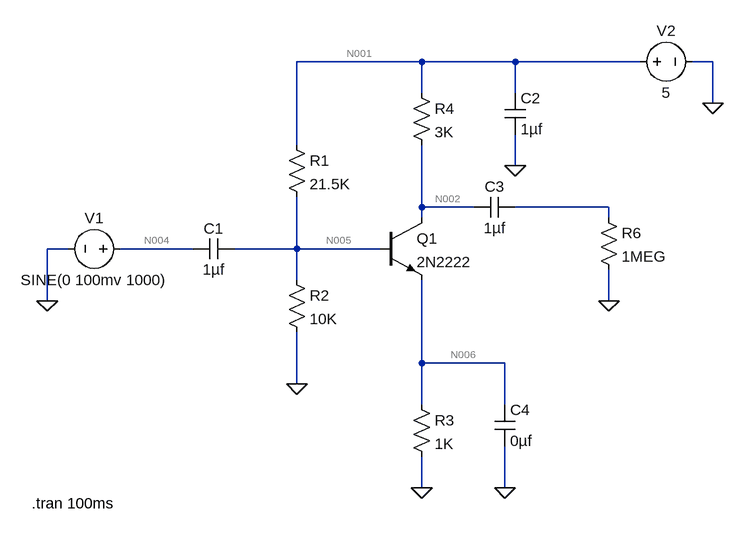
[diagram p0: schematic class_a_amplifier_5v_vcc.asc]
class_a_amplifier_5v_vcc.asc, the LTspice schematic file:
Version 4
SHEET 1 924 680
WIRE 32 -64 -160 -64
WIRE 176 -64 32 -64
WIRE 368 -64 176 -64
WIRE 480 -64 448 -64
WIRE 32 -16 32 -64
WIRE 176 -16 176 -64
WIRE 480 0 480 -64
WIRE -160 64 -160 -64
WIRE 176 96 176 48
WIRE 32 160 32 64
WIRE 112 160 32 160
WIRE 320 160 176 160
WIRE 32 176 32 160
WIRE 320 176 320 160
WIRE -512 224 -544 224
WIRE -320 224 -432 224
WIRE -160 224 -160 144
WIRE -160 224 -256 224
WIRE -32 224 -160 224
WIRE -160 272 -160 224
WIRE -544 304 -544 224
WIRE 320 304 320 256
WIRE 32 400 32 272
WIRE 160 400 32 400
WIRE -160 432 -160 352
WIRE 32 464 32 400
WIRE 160 464 160 400
WIRE 32 592 32 544
WIRE 160 592 160 528
FLAG 480 0 0
FLAG 32 592 0
FLAG -160 432 0
FLAG -544 304 0
FLAG 320 304 0
FLAG 176 96 0
FLAG 160 592 0
SYMBOL voltage -416 224 R90
WINDOW 0 -32 56 VBottom 2
WINDOW 3 32 56 VTop 2
WINDOW 123 60 56 VTop 2
WINDOW 39 0 0 Left 2
SYMATTR InstName V1
SYMATTR Value SINE(0 100mv 1000)
SYMBOL voltage 352 -64 R270
WINDOW 0 32 56 VTop 2
WINDOW 3 -32 56 VBottom 2
WINDOW 123 0 0 Left 2
WINDOW 39 0 0 Left 2
SYMATTR InstName V2
SYMATTR Value 5
SYMBOL cap -256 208 R90
WINDOW 0 0 32 VBottom 2
WINDOW 3 32 32 VTop 2
SYMATTR InstName C1
SYMATTR Value 1µf
SYMBOL res -176 48 R0
SYMATTR InstName R1
SYMATTR Value 21.5K
SYMBOL res -176 256 R0
SYMATTR InstName R2
SYMATTR Value 10K
SYMBOL res 16 -32 R0
SYMATTR InstName R4
SYMATTR Value 3K
SYMBOL res 16 448 R0
SYMATTR InstName R3
SYMATTR Value 1K
SYMBOL cap 112 176 R270
WINDOW 0 32 32 VTop 2
WINDOW 3 0 32 VBottom 2
SYMATTR InstName C3
SYMATTR Value 1µf
SYMBOL npn -32 176 R0
SYMATTR InstName Q1
SYMATTR Value 2N2222
SYMBOL res 304 160 R0
SYMATTR InstName R6
SYMATTR Value 1MEG
SYMBOL cap 160 -16 R0
SYMATTR InstName C2
SYMATTR Value 1µf
SYMBOL cap 144 464 R0
SYMATTR InstName C4
SYMATTR Value 0µf
TEXT -568 616 Left 2 !.tran 100ms

The netlist it stands for:
* class_a_amplifier_5v_vcc.asc
V1 N004 0 SINE(0 100mv 1000)
V2 N001 0 5
C1 N005 N004 1µf
R1 N001 N005 21.5K
R2 N005 0 10K
R4 N001 N002 3K
R3 N006 0 1K
C3 N002 N003 1µf
Q1 N002 N005 N006 0 2N2222
R6 N003 0 1MEG
C2 N001 0 1µf
C4 N006 0 0µf
.model NPN NPN
.model PNP PNP
.lib standard.bjt
.tran 100ms
.backanno
.end

* Results of the author's LTspice run, read from the files saved beside the schematic
* Operating Point, zero values left out:
*   V(n001) = 5 V
*   V(n005) = 1.557 V
*   V(n002) = 2.301 V
*   V(n006) = 904.2 mV
*   Ic(Q1) = 899.8 µA
*   Ib(Q1) = 4.479 µA
*   Ie(Q1) = -904.2 µA
*   I(R3) = 904.2 µA
*   I(R4) = 899.8 µA
*   I(R2) = 155.7 µA
*   I(R1) = 160.2 µA
*   I(V2) = -1.06 mA
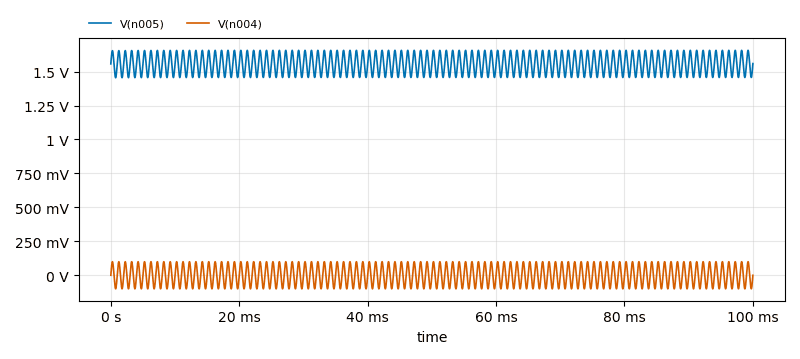
[diagram p1: Transient Analysis of class_a_amplifier_5v_vcc.asc, plotted from the saved traces]
* Transient Analysis, 1 run:
*   V(n005): min 1.455 V, max 1.656 V, average 1.557 V, rms 1.558 V, last 1.559 V
*   V(n004): min -99.72 mV, max 99.76 mV, average -28.36 µV, rms 70.43 mV, last 0 V